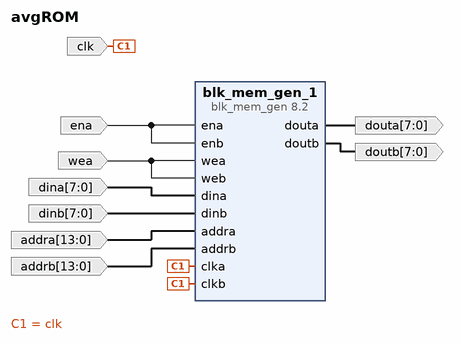
[diagram p0: block diagram of the top level]
# Vivado block design avgROM, Vivado 2015.2
create_bd_design avgROM

create_bd_port -dir I clk
create_bd_port -dir I ena
create_bd_port -dir I wea
create_bd_port -dir I -from 7 -to 0 dina
create_bd_port -dir I -from 7 -to 0 dinb
create_bd_port -dir O -from 7 -to 0 douta
create_bd_port -dir O -from 7 -to 0 doutb
create_bd_port -dir I -from 13 -to 0 addra
create_bd_port -dir I -from 13 -to 0 addrb

create_bd_cell -type ip -vlnv xilinx.com:ip:blk_mem_gen:8.2 blk_mem_gen_1
set_property -dict [list \
  CONFIG.Memory_Type True_Dual_Port_RAM \
  CONFIG.Enable_32bit_Address false \
  CONFIG.Use_Byte_Write_Enable false \
  CONFIG.Write_Width_A 8 \
  CONFIG.Write_Depth_A 16384 \
  CONFIG.Read_Width_A 8 \
  CONFIG.Write_Width_B 8 \
  CONFIG.Read_Width_B 8 \
  CONFIG.Enable_B Use_ENB_Pin \
  CONFIG.Register_PortA_Output_of_Memory_Primitives true \
  CONFIG.Register_PortB_Output_of_Memory_Primitives true \
  CONFIG.Load_Init_File true \
  CONFIG.Coe_File ../../../../new/game_over.coe \
  CONFIG.Fill_Remaining_Memory_Locations true \
  CONFIG.Use_RSTA_Pin false \
  CONFIG.Port_B_Clock 100 \
  CONFIG.Port_B_Write_Rate 50 \
  CONFIG.Port_B_Enable_Rate 100 \
  CONFIG.use_bram_block Stand_Alone \
] [get_bd_cells blk_mem_gen_1]

# ---- connections ----

connect_bd_net [get_bd_ports clk] [get_bd_pins blk_mem_gen_1/clka] [get_bd_pins blk_mem_gen_1/clkb]
connect_bd_net [get_bd_ports ena] [get_bd_pins blk_mem_gen_1/ena] [get_bd_pins blk_mem_gen_1/enb]
connect_bd_net [get_bd_ports wea] [get_bd_pins blk_mem_gen_1/wea] [get_bd_pins blk_mem_gen_1/web]
connect_bd_net [get_bd_ports dina] [get_bd_pins blk_mem_gen_1/dina]
connect_bd_net [get_bd_ports dinb] [get_bd_pins blk_mem_gen_1/dinb]
connect_bd_net -net blk_mem_gen_0_douta [get_bd_pins blk_mem_gen_1/douta] [get_bd_ports douta]
connect_bd_net -net blk_mem_gen_0_doutb [get_bd_pins blk_mem_gen_1/doutb] [get_bd_ports doutb]
connect_bd_net [get_bd_ports addra] [get_bd_pins blk_mem_gen_1/addra]
connect_bd_net [get_bd_ports addrb] [get_bd_pins blk_mem_gen_1/addrb]

validate_bd_design
save_bd_design
